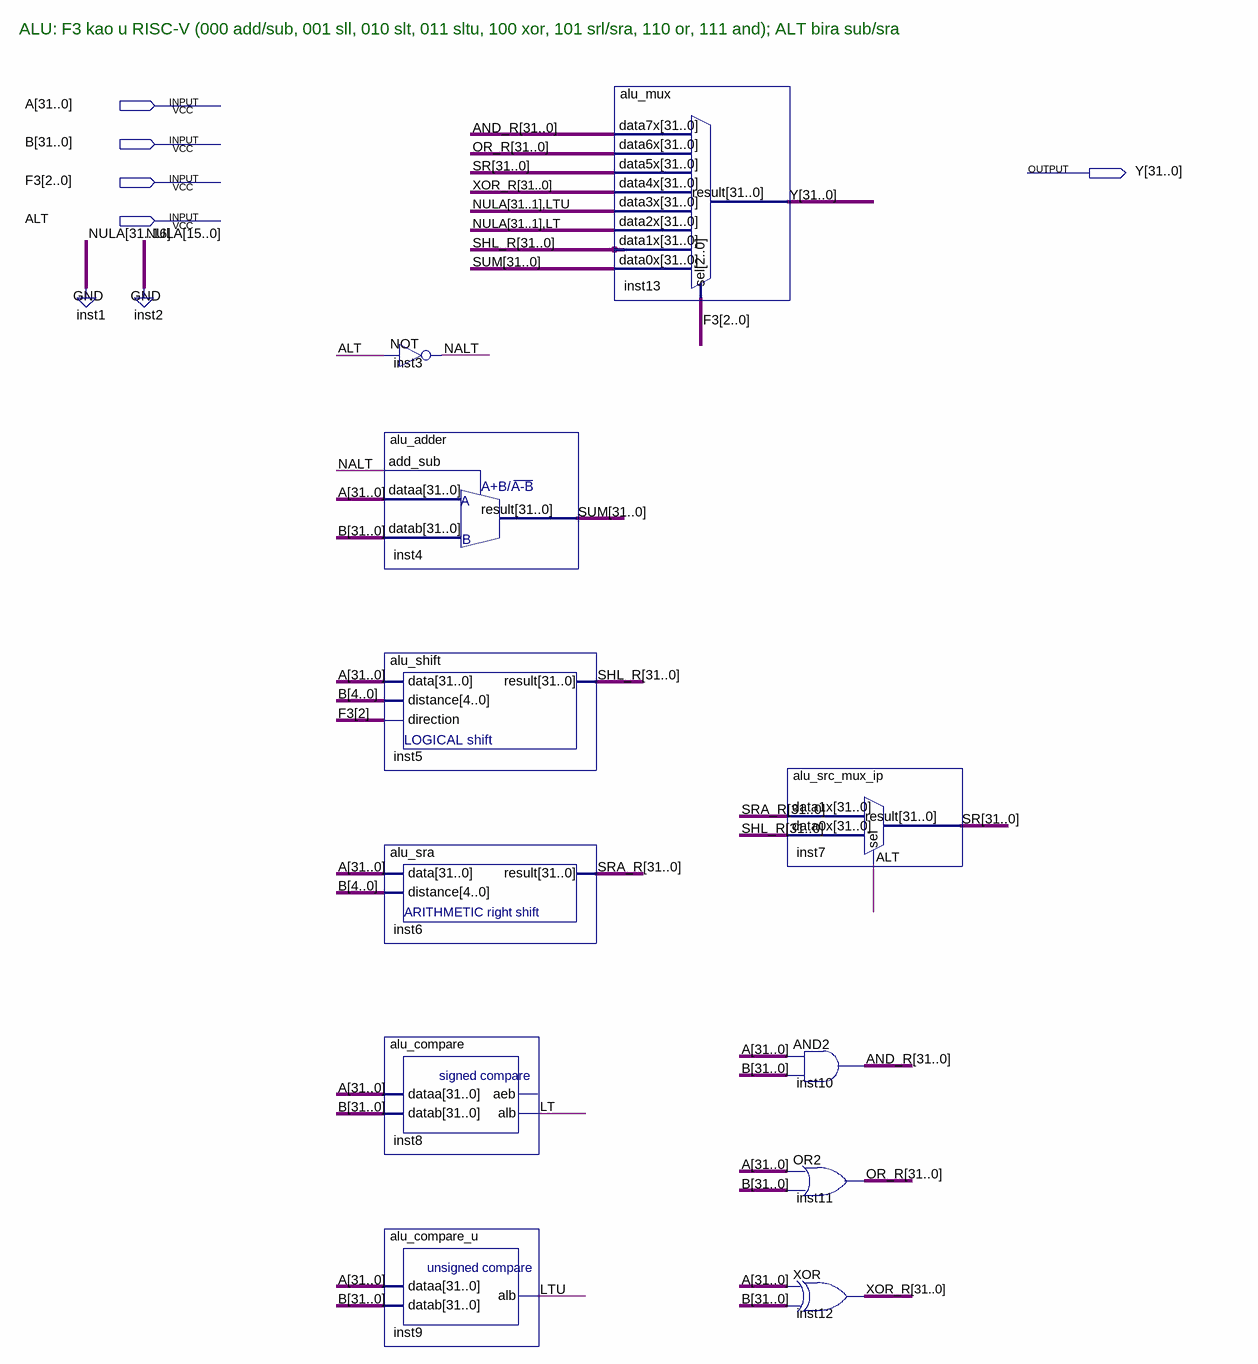
[diagram p0: schematic sheet]
// Quartus schematic alu.bdf as structural Verilog: 11 symbols, 5 pins
module alu (
  input  [31:0] A,
  input  [31:0] B,
  input  [2:0] F3,
  input  ALT,
  output [31:0] Y
);

  wire LT, LTU, NALT;
  wire [31:0] AND_R, OR_R, SHL_R, SR, SRA_R, SUM, XOR_R;

  not inst3 (NALT, ALT);
  alu_adder inst4 (.add_sub(NALT), .dataa(A), .datab(B), .result(SUM));
  alu_shift inst5 (.data(A), .distance(B[4:0]), .direction(F3[2]), .result(SHL_R));
  alu_sra inst6 (.data(A), .distance(B[4:0]), .result(SRA_R));
  alu_compare inst8 (.dataa(A), .datab(B), .alb(LT));  // open: aeb
  alu_compare_u inst9 (.dataa(A), .datab(B), .alb(LTU));
  alu_mux inst13 (
    .data7x(AND_R), .data6x(OR_R), .data5x(SR), .data4x(XOR_R), .data3x({{31{1'b0}}, LTU}),
    .data2x({{31{1'b0}}, LT}), .data1x(SHL_R), .data0x(SUM), .sel(F3), .result(Y));
  alu_src_mux_ip inst7 (.data1x(SRA_R), .data0x(SHL_R), .sel(ALT), .result(SR));
  assign AND_R = A & B;  // AND2 inst10, 32 bits wide
  assign OR_R = A | B;  // OR2 inst11, 32 bits wide
  assign XOR_R = A ^ B;  // XOR inst12, 32 bits wide

  // Notes on the sheet:
  //   ALU: F3 kao u RISC-V (000 add/sub, 001 sll, 010 slt, 011 sltu, 100 xor, 101 srl/sra, 110 or, 111 and); ALT bira sub/sra
endmodule
